# Altium schematic sheet CO2_RF_LCD_103.SchDoc
size 594 x 420 mm; Author: Казаков; PageSetup: Record=PageOptions|CenterHorizontal=True|CenterVertical=True|PrintScale=0.76|XCorrection=1.00|YCorrection=1.00|PrintKind=2|BorderSize=5000000|LeftOffset=0|BottomOffset=0|Orientation=2|PaperLength=1000|PaperWidth=1000|Scale=100|PaperSource=1|PrintQuality=600|MediaType=1|DitherType=10|PaperKind=A3|PrintScaleMode=1
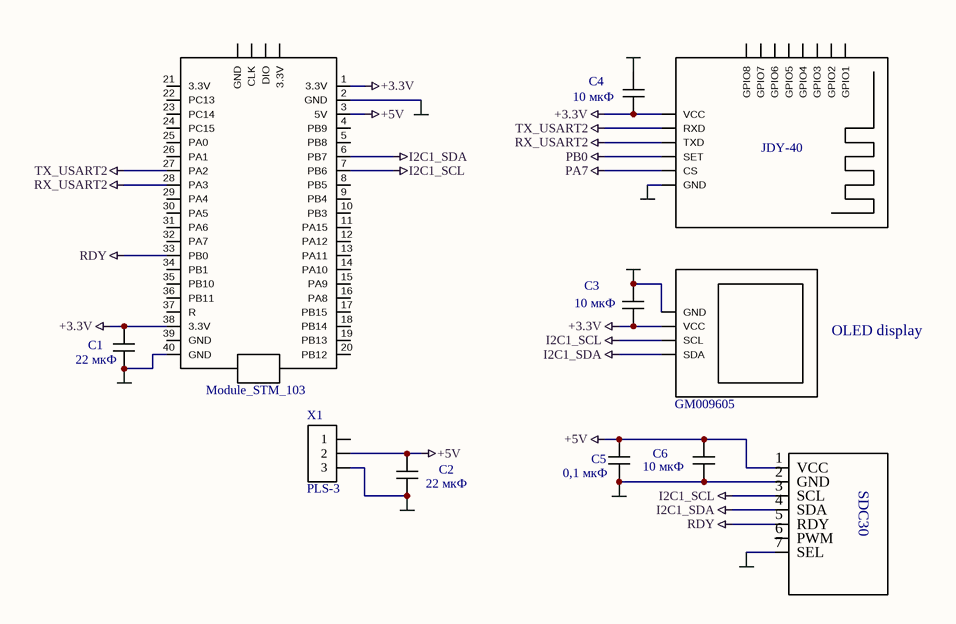
[diagram p0: CO2_RF_LCD_103.SchDoc]

## Parts
(Parts that share a designator on the sheet are numbered #1, #2 ... from top to bottom, then left to right.)
*#1  Module_STM_103
*#2  JDY-40
C1  22 мкФ  [1210C]
C2  22 мкФ  [0603C]
C3  10 мкФ  [1210C]
C4  10 мкФ  [1210C]
C5  0,1 мкФ  [0603C]
C6  10 мкФ  [1210C]
DP1  GM009605
M1  Module_SDC30  (value not drawn)
X1  PLS-3  [PLS_3]

## Nets
+3.3V: *#1.1(3.3V) *#1.38(3.3V) *#2.9(VCC) C1.2 C3.1 C4.1 DP1.1(VCC)
+5V: *#1.3(5V) C2.2 C5.2 C6.2 M1.1(VCC) X1.2
GND: *#1.2(GND) *#1.40(GND) *#2.14(GND) C1.1 C2.1 C3.2 C4.2 C5.1 C6.1 DP1.4(GND) M1.2(GND) M1.7(SEL) X1.3
I2C1_SCL: *#1.7(PB6) DP1.3(SCL) M1.3(SCL)
I2C1_SDA: *#1.6(PB7) DP1.2(SDA) M1.4(SDA)
PA7: *#2.13(CS)
PB0: *#2.12(SET)
RDY: *#1.33(PB0) M1.5(RDY)
RX_USART2: *#1.28(PA3) *#2.11(TXD)
TX_USART2: *#1.27(PA2) *#2.10(RXD)

Not connected (* = marked no-connect by the designer): *#1 4(PB9) 5(PB8) 8(PB5) 9(PB4) 10(PB3) 11(PA15) 12(PA12) 13(PA11) 14(PA10) 15(PA9) 16(PA8) 17(PB15) 18(PB14) 19(PB13) 20(PB12) 21(3.3V) 22(PC13) 23(PC14) 24(PC15) 25(PA0) 26(PA1) 29(PA4) 30(PA5) 31(PA6) 32(PA7) 34(PB1) 35(PB10) 36(PB11) 37(R) 39(GND); *#2 1(GPIO1) 2(GPIO2) 3(GPIO3) 4(GPIO4) 5(GPIO5) 6(GPIO6) 7(GPIO7) 8(GPIO8); M1 6(PWM); X1 1

## Notes on the sheet
- OLED display
- Подп. и дата
- Инв. № дубл.
- Взам. инв. №
- Изм.
- Разраб.
- Лист
- № Докум.
- Подп.
- Дата
- Лит.
- Масса
- Масштаб
- Т. контр.
- Проверил
- Листов
- Инв. № подл.
- Утв.
- Н. контр.
- Копировал
- Формат А2
- (in symbol Module_SDC30) SDC30

## Library data of the parts
C1-C6 = Capacitor
  C1 C2: Value: 22 мкФ
  C3 C4 C6: Value: 10 мкФ
  C5: Value: 0,1 мкФ
DP1 = OLDE_I2C_09
X1 = CONT_3